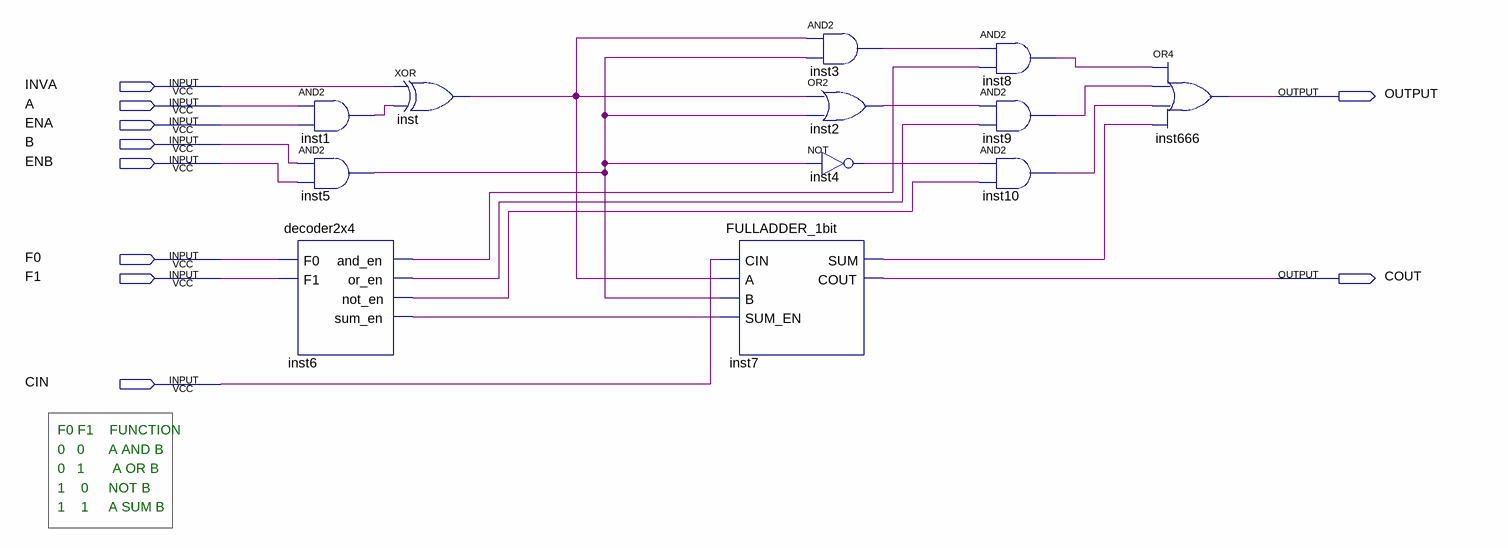
[diagram p0: schematic sheet]
// Quartus schematic ULA_1bit.bdf as structural Verilog: 12 symbols, 10 pins
module ULA_1bit (
  input  INVA,
  input  A,
  input  ENA,
  input  B,
  input  ENB,
  input  F0,
  input  F1,
  input  CIN,
  output OUTPUT,
  output COUT
);

  wire inst1_out, inst2_out, inst3_out, inst4_out, inst5_out, inst6_and_en, inst6_not_en, inst6_or_en,
       inst6_sum_en, inst7_sum, inst8_out, inst9_out, inst10_out, inst_out;

  and inst1 (inst1_out, A, ENA);
  and inst5 (inst5_out, B, ENB);
  decoder2x4 inst6 (
    .F0(F0), .F1(F1), .and_en(inst6_and_en), .or_en(inst6_or_en), .not_en(inst6_not_en), .sum_en(inst6_sum_en));
  xor inst (inst_out, INVA, inst1_out);
  FULLADDER_1bit inst7 (.CIN(CIN), .A(inst_out), .B(inst5_out), .SUM_EN(inst6_sum_en), .SUM(inst7_sum), .COUT(COUT));
  and inst3 (inst3_out, inst_out, inst5_out);
  or inst2 (inst2_out, inst_out, inst5_out);
  not inst4 (inst4_out, inst5_out);
  and inst8 (inst8_out, inst3_out, inst6_and_en);
  and inst9 (inst9_out, inst2_out, inst6_or_en);
  and inst10 (inst10_out, inst4_out, inst6_not_en);
  or inst666 (OUTPUT, inst8_out, inst9_out, inst10_out, inst7_sum);

  // Notes on the sheet:
  //   F0 F1    FUNCTION
  //   0   0      A AND B
  //   0   1       A OR B
  //   1    0     NOT B
  //   1    1     A SUM B
endmodule
